# Altium schematic sheet 100 Pin Header Breakout Schematic.SchDoc
size A3; SheetNumber: 2; SheetTotal: 3
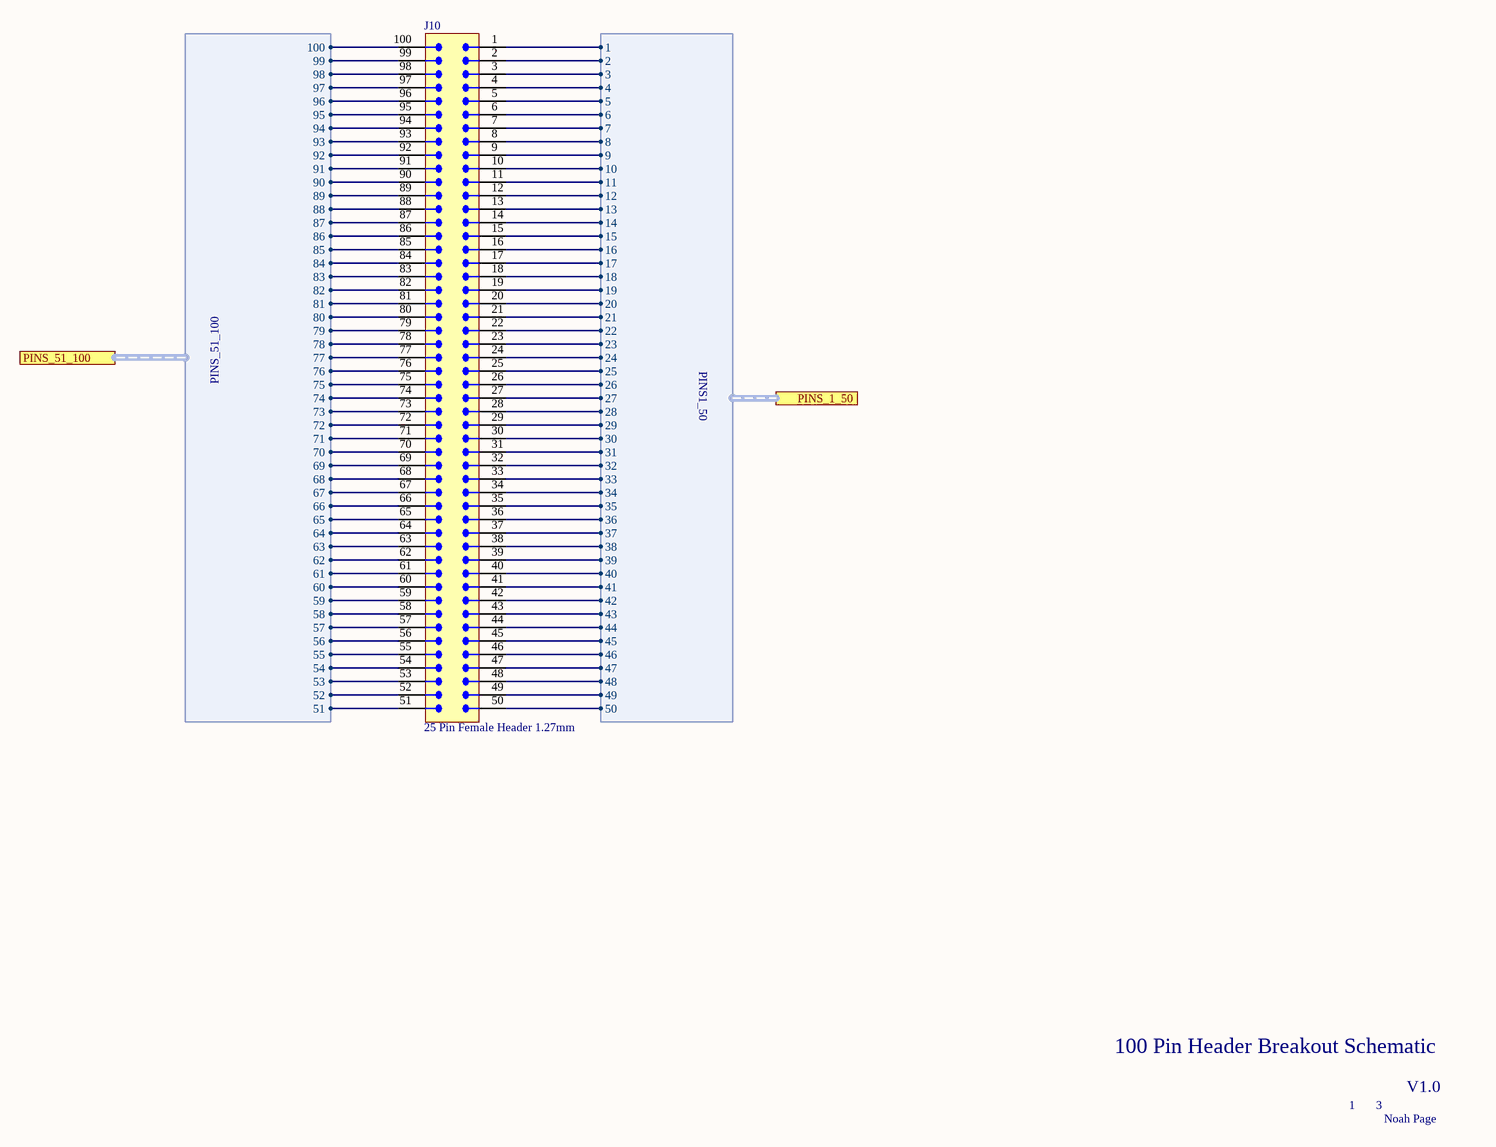
[diagram p0: 100 Pin Header Breakout Schematic.SchDoc]

## Parts
J10  25 Pin Female Header 1.27mm  [4x 25 Pin 1.27mm Female Header]

## Ports
PINS_1_50 (harness PINS1_50, see Microcontroller Schematic[6B]), PINS_51_100 (harness PINS_51_100, see Microcontroller Schematic[8B])

## Harnesses
PINS_51_100: 51, 52, 53, 54, 55, 56, 57, 58, 59, 60, 61, 62, 63, 64, 65, 66, 67, 68, 69, 70, 71, 72, 73, 74, 75, 76, 77, 78, 79, 80, 81, 82, 83, 84, 85, 86, 87, 88, 89, 90, 91, 92, 93, 94, 95, 96, 97, 98, 99, 100
PINS1_50: 1, 2, 3, 4, 5, 6, 7, 8, 9, 10, 11, 12, 13, 14, 15, 16, 17, 18, 19, 20, 21, 22, 23, 24, 25, 26, 27, 28, 29, 30, 31, 32, 33, 34, 35, 36, 37, 38, 39, 40, 41, 42, 43, 44, 45, 46, 47, 48, 49, 50

## Nets
NetJ10_1: J10.1 ; port PINS_1_50.1
NetJ10_2: J10.2 ; port PINS_1_50.2
NetJ10_3: J10.3 ; port PINS_1_50.3
NetJ10_4: J10.4 ; port PINS_1_50.4
NetJ10_5: J10.5 ; port PINS_1_50.5
NetJ10_6: J10.6 ; port PINS_1_50.6
NetJ10_7: J10.7 ; port PINS_1_50.7
NetJ10_8: J10.8 ; port PINS_1_50.8
NetJ10_9: J10.9 ; port PINS_1_50.9
NetJ10_10: J10.10 ; port PINS_1_50.10
NetJ10_11: J10.11 ; port PINS_1_50.11
NetJ10_12: J10.12 ; port PINS_1_50.12
NetJ10_13: J10.13 ; port PINS_1_50.13
NetJ10_14: J10.14 ; port PINS_1_50.14
NetJ10_15: J10.15 ; port PINS_1_50.15
NetJ10_16: J10.16 ; port PINS_1_50.16
NetJ10_17: J10.17 ; port PINS_1_50.17
NetJ10_18: J10.18 ; port PINS_1_50.18
NetJ10_19: J10.19 ; port PINS_1_50.19
NetJ10_20: J10.20 ; port PINS_1_50.20
NetJ10_21: J10.21 ; port PINS_1_50.21
NetJ10_22: J10.22 ; port PINS_1_50.22
NetJ10_23: J10.23 ; port PINS_1_50.23
NetJ10_24: J10.24 ; port PINS_1_50.24
NetJ10_25: J10.25 ; port PINS_1_50.25
NetJ10_26: J10.26 ; port PINS_1_50.26
NetJ10_27: J10.27 ; port PINS_1_50.27
NetJ10_28: J10.28 ; port PINS_1_50.28
NetJ10_29: J10.29 ; port PINS_1_50.29
NetJ10_30: J10.30 ; port PINS_1_50.30
NetJ10_31: J10.31 ; port PINS_1_50.31
NetJ10_32: J10.32 ; port PINS_1_50.32
NetJ10_33: J10.33 ; port PINS_1_50.33
NetJ10_34: J10.34 ; port PINS_1_50.34
NetJ10_35: J10.35 ; port PINS_1_50.35
NetJ10_36: J10.36 ; port PINS_1_50.36
NetJ10_37: J10.37 ; port PINS_1_50.37
NetJ10_38: J10.38 ; port PINS_1_50.38
NetJ10_39: J10.39 ; port PINS_1_50.39
NetJ10_40: J10.40 ; port PINS_1_50.40
NetJ10_41: J10.41 ; port PINS_1_50.41
NetJ10_42: J10.42 ; port PINS_1_50.42
NetJ10_43: J10.43 ; port PINS_1_50.43
NetJ10_44: J10.44 ; port PINS_1_50.44
NetJ10_45: J10.45 ; port PINS_1_50.45
NetJ10_46: J10.46 ; port PINS_1_50.46
NetJ10_47: J10.47 ; port PINS_1_50.47
NetJ10_48: J10.48 ; port PINS_1_50.48
NetJ10_49: J10.49 ; port PINS_1_50.49
NetJ10_50: J10.50 ; port PINS_1_50.50
NetJ10_51: J10.51 ; port PINS_51_100.51
NetJ10_52: J10.52 ; port PINS_51_100.52
NetJ10_53: J10.53 ; port PINS_51_100.53
NetJ10_54: J10.54 ; port PINS_51_100.54
NetJ10_55: J10.55 ; port PINS_51_100.55
NetJ10_56: J10.56 ; port PINS_51_100.56
NetJ10_57: J10.57 ; port PINS_51_100.57
NetJ10_58: J10.58 ; port PINS_51_100.58
NetJ10_59: J10.59 ; port PINS_51_100.59
NetJ10_60: J10.60 ; port PINS_51_100.60
NetJ10_61: J10.61 ; port PINS_51_100.61
NetJ10_62: J10.62 ; port PINS_51_100.62
NetJ10_63: J10.63 ; port PINS_51_100.63
NetJ10_64: J10.64 ; port PINS_51_100.64
NetJ10_65: J10.65 ; port PINS_51_100.65
NetJ10_66: J10.66 ; port PINS_51_100.66
NetJ10_67: J10.67 ; port PINS_51_100.67
NetJ10_68: J10.68 ; port PINS_51_100.68
NetJ10_69: J10.69 ; port PINS_51_100.69
NetJ10_70: J10.70 ; port PINS_51_100.70
NetJ10_71: J10.71 ; port PINS_51_100.71
NetJ10_72: J10.72 ; port PINS_51_100.72
NetJ10_73: J10.73 ; port PINS_51_100.73
NetJ10_74: J10.74 ; port PINS_51_100.74
NetJ10_75: J10.75 ; port PINS_51_100.75
NetJ10_76: J10.76 ; port PINS_51_100.76
NetJ10_77: J10.77 ; port PINS_51_100.77
NetJ10_78: J10.78 ; port PINS_51_100.78
NetJ10_79: J10.79 ; port PINS_51_100.79
NetJ10_80: J10.80 ; port PINS_51_100.80
NetJ10_81: J10.81 ; port PINS_51_100.81
NetJ10_82: J10.82 ; port PINS_51_100.82
NetJ10_83: J10.83 ; port PINS_51_100.83
NetJ10_84: J10.84 ; port PINS_51_100.84
NetJ10_85: J10.85 ; port PINS_51_100.85
NetJ10_86: J10.86 ; port PINS_51_100.86
NetJ10_87: J10.87 ; port PINS_51_100.87
NetJ10_88: J10.88 ; port PINS_51_100.88
NetJ10_89: J10.89 ; port PINS_51_100.89
NetJ10_90: J10.90 ; port PINS_51_100.90
NetJ10_91: J10.91 ; port PINS_51_100.91
NetJ10_92: J10.92 ; port PINS_51_100.92
NetJ10_93: J10.93 ; port PINS_51_100.93
NetJ10_94: J10.94 ; port PINS_51_100.94
NetJ10_95: J10.95 ; port PINS_51_100.95
NetJ10_96: J10.96 ; port PINS_51_100.96
NetJ10_97: J10.97 ; port PINS_51_100.97
NetJ10_98: J10.98 ; port PINS_51_100.98
NetJ10_99: J10.99 ; port PINS_51_100.99
NetJ10_100: J10.100 ; port PINS_51_100.100

## Notes on the sheet
- 100 Pin Header Breakout Schematic
- 1
- 3
- V1.0
- Noah Page

## Library data of the parts
J10 = 25 Pin Female Header 1.27mm: Digi-Key_Part_Number_1: 1212-1363-ND